# EAGLE design PCB (EAGLE 9.6.2)
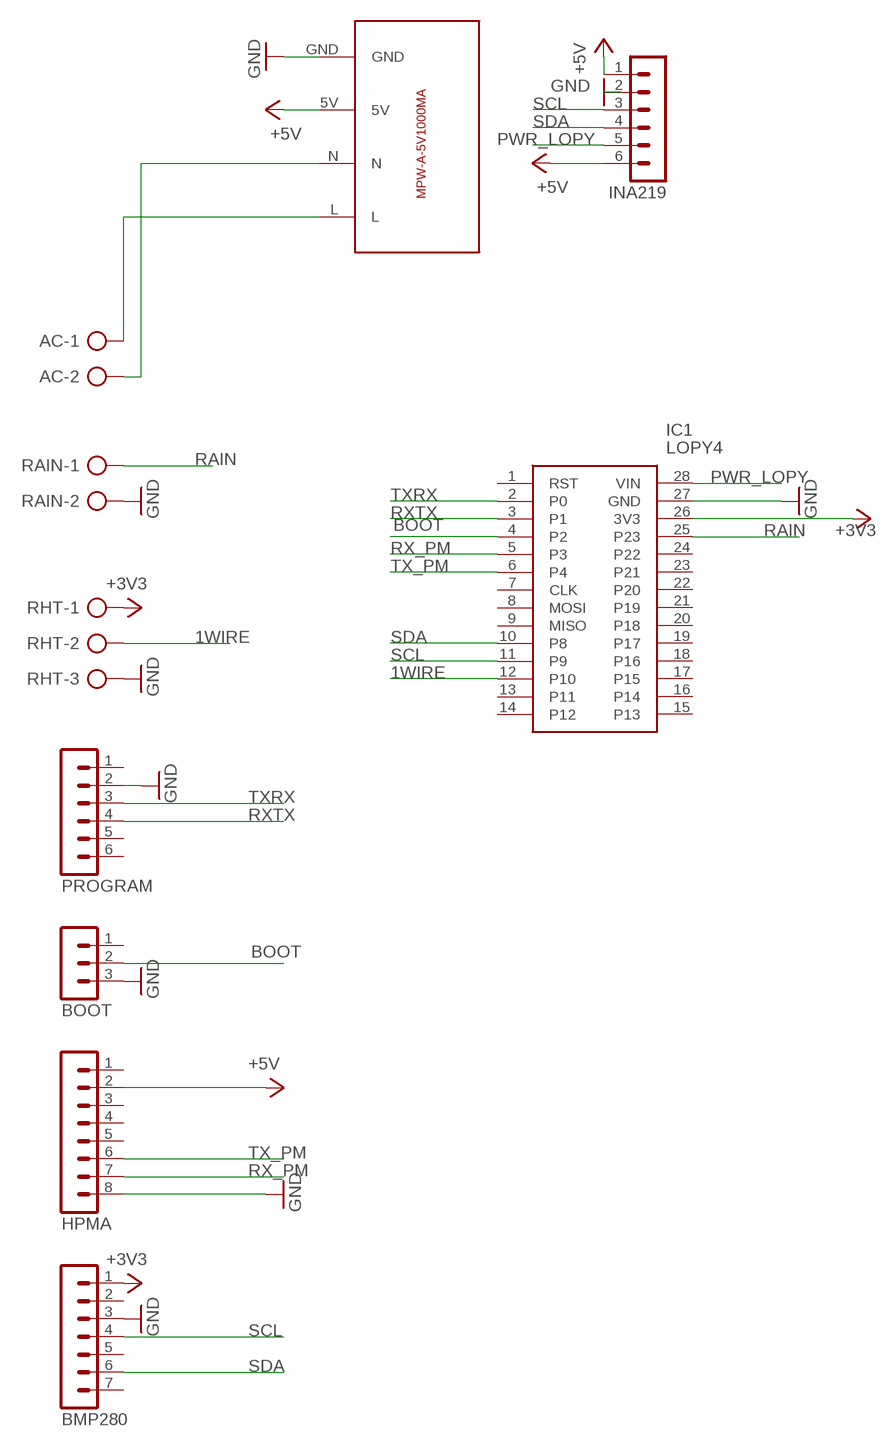
[diagram p0: schematic, sheet 1]

## Parts
AC  AK300/2  [AK300/2]
BMP280  MA07-1  [MA07-1]
BOOT  MA03-1  [MA03-1]
HPMA  MA08-1  [MA08-1]
IC1  LOPY4  [LOPY4]
INA219  MA06-1  [MA06-1]
PROGRAM  MA06-1  [MA06-1]
RAIN  AK300/2  [AK300/2]
RHT  AK300/3  [AK300/3]
U$1  MPW-A-5V1000MA  [MPW-A-5V1000MA]

## Nets
1WIRE: IC1.12(P10) RHT.2
+3V3 [power]: BMP280.1 IC1.26(3V3) RHT.1
+5V [power]: HPMA.2 INA219.1 INA219.6 U$1.5V
BOOT: BOOT.2 IC1.4(P2)
GND [power]: BMP280.3 BOOT.3 HPMA.8 IC1.27(GND) INA219.2 PROGRAM.2 RAIN.2 RHT.3 U$1.GND
N$1 [power]: AC.1 U$1.L
N$2 [power]: AC.2 U$1.N
PWR_LOPY: IC1.28(VIN) INA219.5
RAIN: IC1.25(P23) RAIN.1
RX_PM: HPMA.7 IC1.5(P3)
RXTX: IC1.3(P1) PROGRAM.4
SCL: BMP280.4 IC1.11(P9) INA219.3
SDA: BMP280.6 IC1.10(P8) INA219.4
TX_PM: HPMA.6 IC1.6(P4)
TXRX: IC1.2(P0) PROGRAM.3
Unconnected: BMP280.2 BMP280.5 BMP280.7 BOOT.1 HPMA.1 HPMA.3 HPMA.4 HPMA.5 IC1.1(RST) IC1.7(CLK) IC1.8(MOSI) IC1.9(MISO) IC1.13(P11) IC1.14(P12) IC1.15(P13) IC1.16(P14) IC1.17(P15) IC1.18(P16) IC1.19(P17) IC1.20(P18) IC1.21(P19) IC1.22(P20) IC1.23(P21) IC1.24(P22) PROGRAM.1 PROGRAM.5 PROGRAM.6

## Library data of the parts
AC RAIN = con-ptr500:AK300/2: CONNECTOR; OC_FARNELL: unknown; OC_NEWARK: unknown
BMP280 = con-lstb:MA07-1: PIN HEADER; OC_FARNELL: unknown; OC_NEWARK: unknown
BOOT = con-lstb:MA03-1: PIN HEADER; OC_FARNELL: unknown; OC_NEWARK: unknown
HPMA = con-lstb:MA08-1: PIN HEADER; OC_FARNELL: unknown; OC_NEWARK: unknown
IC1 = LOPY4:LOPY4: Pycom Pycom LoPy4 Bluetooth Smart (BLE), LoRa, SigFox, WiFi Development Board Source: Datasheet <https://pycom.io/wp-content/uploads/2018/03/Pycom_Specsheet_LoPy4.pdf>; ARROW_PART_NUMBER: LOPY4; ARROW_PRICE-STOCK: https://www.arrow.com/en/products/lopy4/pycom-ltd; DESCRIPTION: Pycom Pycom LoPy4 Bluetooth Smart (BLE), LoRa, SigFox, WiFi Development Board; HEIGHT: 5mm; MANUFACTURER_NAME: Pycom; MANUFACTURER_PART_NUMBER: LOPY4; MOUSER_PART_NUMBER: 365-LOPY4; MOUSER_PRICE-STOCK: https://www.mouser.com/Search/Refine.aspx?Keyword=365-LOPY4
INA219 PROGRAM = con-lstb:MA06-1: PIN HEADER; OC_FARNELL: unknown; OC_NEWARK: unknown
RHT = con-ptr500:AK300/3: CONNECTOR; OC_FARNELL: unknown; OC_NEWARK: unknown
U$1 = utils:MPW-A-5V1000MA

## Net classes
1 power: width 0.508 mm

## Board
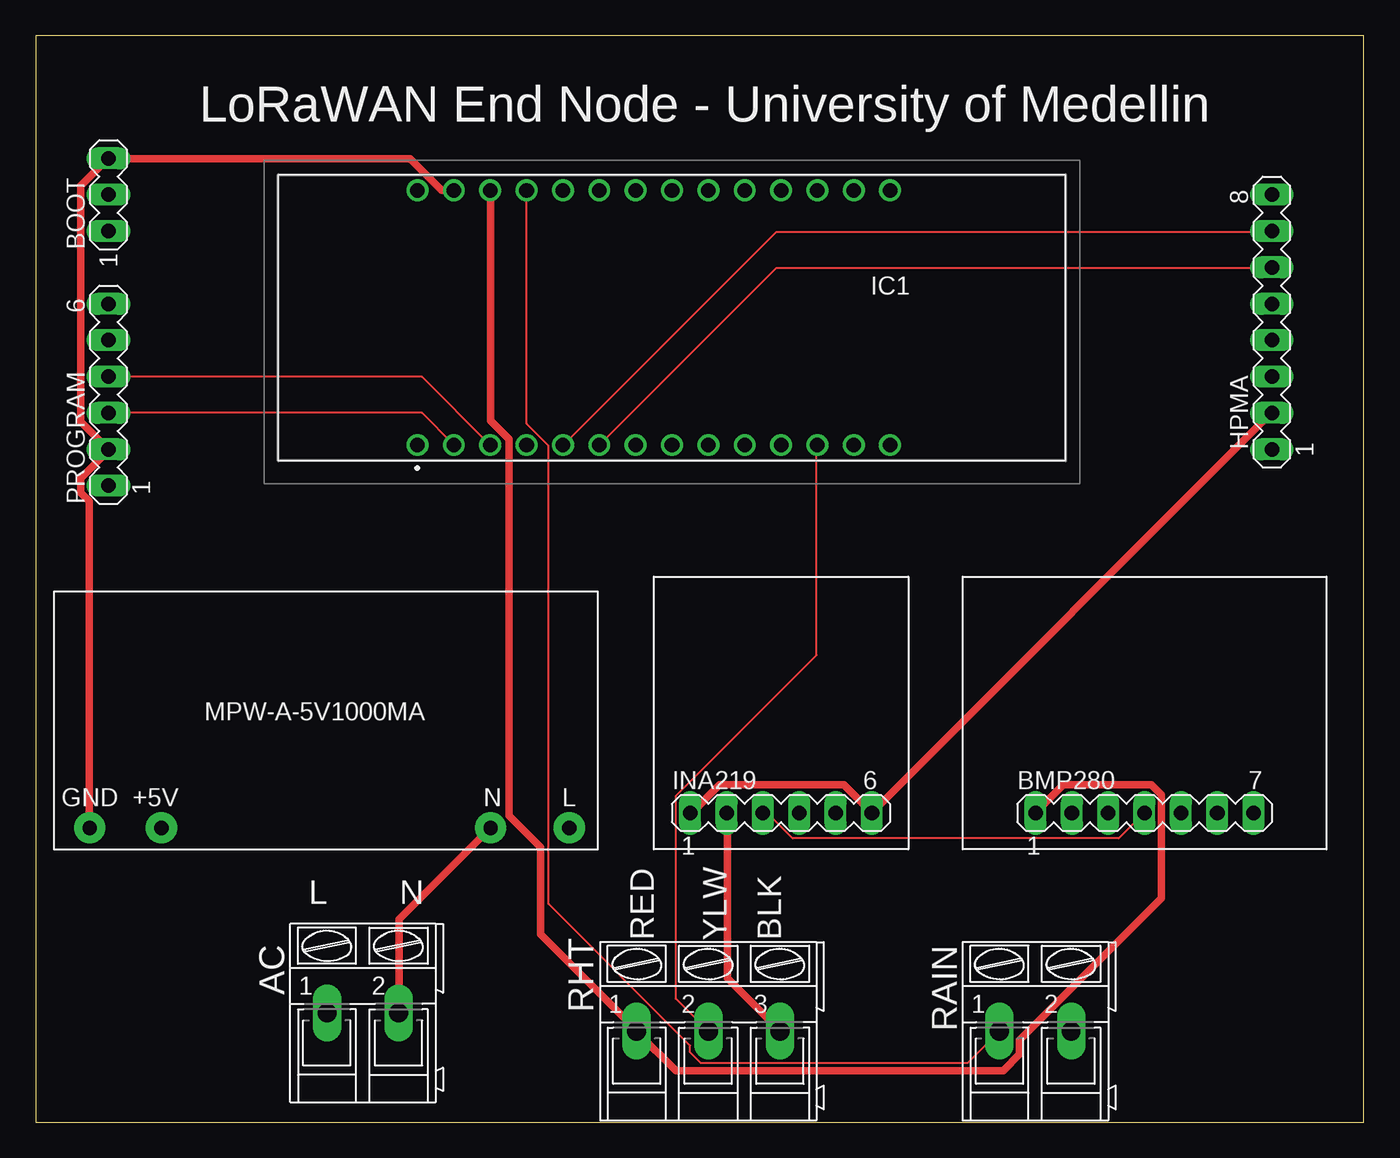
[diagram p1: board, top side]
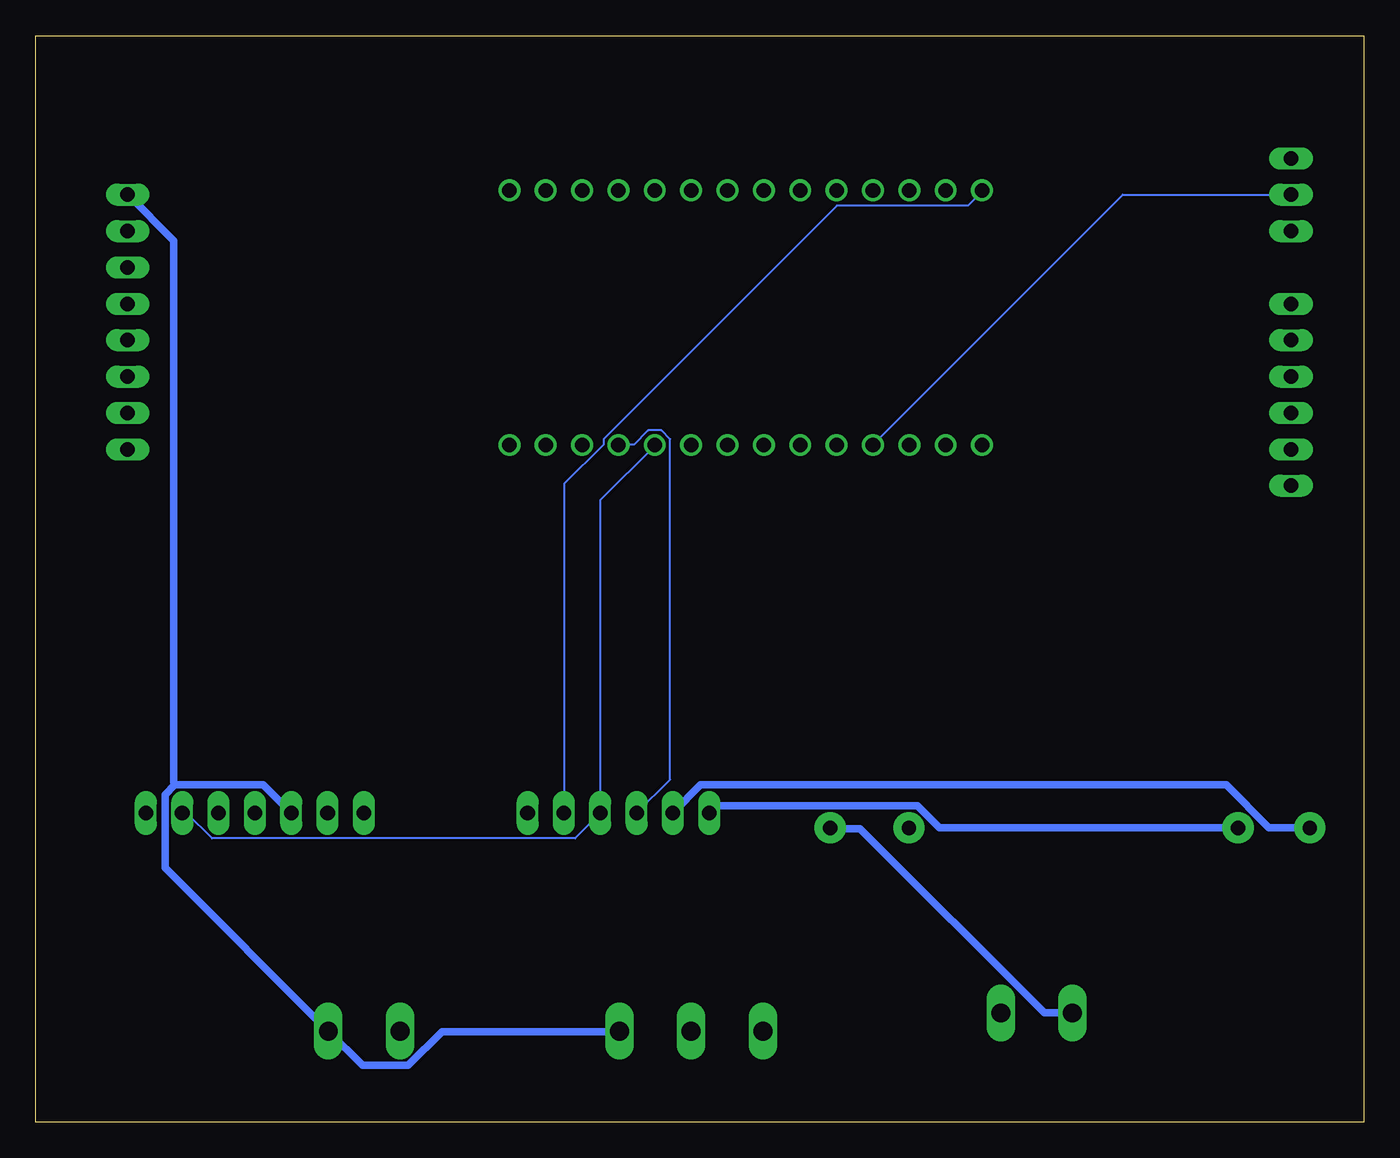
[diagram p2: board, bottom side, seen from below]

Size 92.78 x 75.87 mm. Coordinates in mm from the lower left corner, seen from the top.
Outline: 0,0 92.78,0 92.78,75.87 0,75.87 0,0
Copper layers (1*16): Top 0.035mm / dielectric 1.5mm / Bottom 0.035mm
Design rules "default": minimum track width 6mil, minimum drill 0.35mm, track to track 6mil, track to pad 6mil, pad to pad 6mil, via to via 6mil, smd to smd 6mil, copper to edge 40mil, drill to drill 6mil, minimum pad ring 10mil, minimum via ring 8mil, stop-mask expansion 4mil, vias tented up to drill 0mil, thermal gap 10mil

### Footprints (pad centres in the part's own frame; a part is rotated, then mirrored left to right if it is on the bottom)
AK300/2 = drill 1.321 long: 1 -2.515,0; 2 2.489,0
MA07-1 = drill 1.016 long: 1 -7.62,0; 2 -5.08,0; 3 -2.54,0; 4 0,0; 5 2.54,0; 6 5.08,0; 7 7.62,0
MA03-1 = drill 1.016 long: 1 -2.54,0; 2 0,0; 3 2.54,0
MA08-1 = drill 1.016 long: 1 -8.89,0; 2 -6.35,0; 3 -3.81,0; 4 -1.27,0; 5 1.27,0; 6 3.81,0; 7 6.35,0; 8 8.89,0
LOPY4 = drill 1.02 pad 1.53: 1 -17.78,-8.59; 2 -15.24,-8.59; 3 -12.7,-8.59; 4 -10.16,-8.59; 5 -7.62,-8.59; 6 -5.08,-8.59; 7 -2.54,-8.59; 8 0,-8.59; 9 2.54,-8.59; 10 5.08,-8.59; 11 7.62,-8.59; 12 10.16,-8.59; 13 12.7,-8.59; 14 15.24,-8.59; 15 15.24,9.19; 16 12.7,9.19; 17 10.16,9.19; 18 7.62,9.19; 19 5.08,9.19; 20 2.54,9.19; 21 0,9.19; 22 -2.54,9.19; 23 -5.08,9.19; 24 -7.62,9.19; 25 -10.16,9.19; 26 -12.7,9.19; 27 -15.24,9.19; 28 -17.78,9.19
MA06-1 = drill 1.016 long: 1 -6.35,0; 2 -3.81,0; 3 -1.27,0; 4 1.27,0; 5 3.81,0; 6 6.35,0
AK300/3 = drill 1.321 long: 1 -5.004,0; 2 0,0; 3 5.004,0
MPW-A-5V1000MA = drill 1 pad 2.184: 5V 7.5,1.5; GND 2.5,1.5; L 36,1.5; N 30.5,1.5

### Placement (x,y rotation side)
AC  22.86,7.62 0 top
BMP280  77.47,21.59 0 top
BOOT  5.08,64.77 90 top
HPMA  86.36,55.88 90 top
IC1  44.45,55.88 0 top
INA219  52.07,21.59 0 top
PROGRAM  5.08,50.8 90 top
RAIN  69.85,6.35 0 top
RHT  46.99,6.35 0 top
U$1  1.27,19.05 0 top

### Tracks (layer width: path | path; a pad name or v marks a point on that pad's centre or on a via)
1WIRE
  Top 0.152: RHT.2 44.73,8.61 44.73,22.78 54.56,32.61 54.56,47.24 IC1.12
+3V3
  Top 0.508: BMP280.1 69.88,21.64 71.78,23.55 77.95,23.55 78.64,22.86 78.64,15.62 68.73,5.71 68.73,4.72 67.59,3.58 44.73,3.58 41.99,6.33 RHT.1 41.83,6.55 35.28,13.11 35.28,19.2 33.07,21.41 33.07,47.7 31.77,49 31.77,65 IC1.26
+5V
  Top 0.508: INA219.1 45.72,21.64 45.87,21.64 47.78,23.55 56.46,23.55 INA219.6 58.52,21.72 86.33,49.53 HPMA.2
  Bottom 0.508: U$1.5V 8.84,20.57 29.64,20.57 31.17,22.1 45.26,22.1 45.72,21.64 INA219.1
BOOT
  Bottom 0.152: BOOT.2 16.84,64.77 34.29,47.32 IC1.4
GND
  Top 0.508: IC1.27 29.18,65.08 28.35,65.08 26.14,67.28 5.33,67.28 BOOT.3 5.03,67.28 3.12,65.38 3.12,48.92 5.03,47.02 PROGRAM.2 4.95,46.79 3.12,44.96 3.12,43.97 3.73,43.36 3.73,20.57 U$1.GND | INA219.2 48.31,21.57 48.31,10.06 51.97,6.4 RHT.3
  Bottom 0.508: BMP280.3 76.89,23.55 83.06,23.55 | 83.06,23.55 83.74,22.86 83.74,17.75 RAIN.2 69.95,3.96 66.75,3.96 64.39,6.33 52.05,6.33 RHT.3 | HPMA.8 86.33,64.77 83.13,61.57 83.13,23.77 83.06,23.55 | U$1.GND 3.81,20.57 6.63,20.57 9.6,23.55 46.33,23.55 48.23,21.64 INA219.2
N$1
  Bottom 0.508: AC.1 22.33,7.62 35.2,20.5 37.26,20.5 U$1.L
N$2
  Top 0.508: AC.2 25.38,7.62 25.38,14.17 31.7,20.5 U$1.N
PWR_LOPY
  Bottom 0.152: INA219.5 55.85,21.64 55.85,44.58 53.11,47.32 53.11,47.7 36.8,64.01 27.66,64.01 26.67,65 IC1.28
RAIN
  Top 0.152: IC1.25 34.29,48.77 35.81,47.24 35.81,15.24 45.72,5.33 45.72,4.88 46.48,4.12 65.08,4.12 67.28,6.33 RAIN.1
RX_PM
  Top 0.152: HPMA.7 86.33,62.18 51.74,62.18 36.88,47.32 IC1.5
RXTX
  Top 0.152: PROGRAM.4 5.11,52.05 26.98,52.05 31.7,47.32 IC1.3
SCL
  Top 0.152: INA219.3 50.83,21.57 51.13,21.57 52.88,19.81 75.67,19.81 77.42,21.57 BMP280.4
  Bottom 0.152: INA219.3 48.46,23.93 48.46,47.7 49.07,48.31 49.99,48.31 50.98,47.32 52.05,47.32 IC1.11
SDA
  Bottom 0.152: IC1.10 49.53,47.24 53.34,43.43 INA219.4 53.34,21.57 55.09,19.81 80.47,19.81 82.22,21.57 82.53,21.57 BMP280.6
TX_PM
  Top 0.152: HPMA.6 86.33,59.66 51.74,59.66 39.4,47.32 IC1.6
TXRX
  Top 0.152: PROGRAM.3 26.98,49.53 29.18,47.32 IC1.2

### Text on the board
tNames: LoRaWAN End Node - University of Medellin | L | N | RED | YLW | BLK